# EAGLE design eprom-player (EAGLE 6.1)
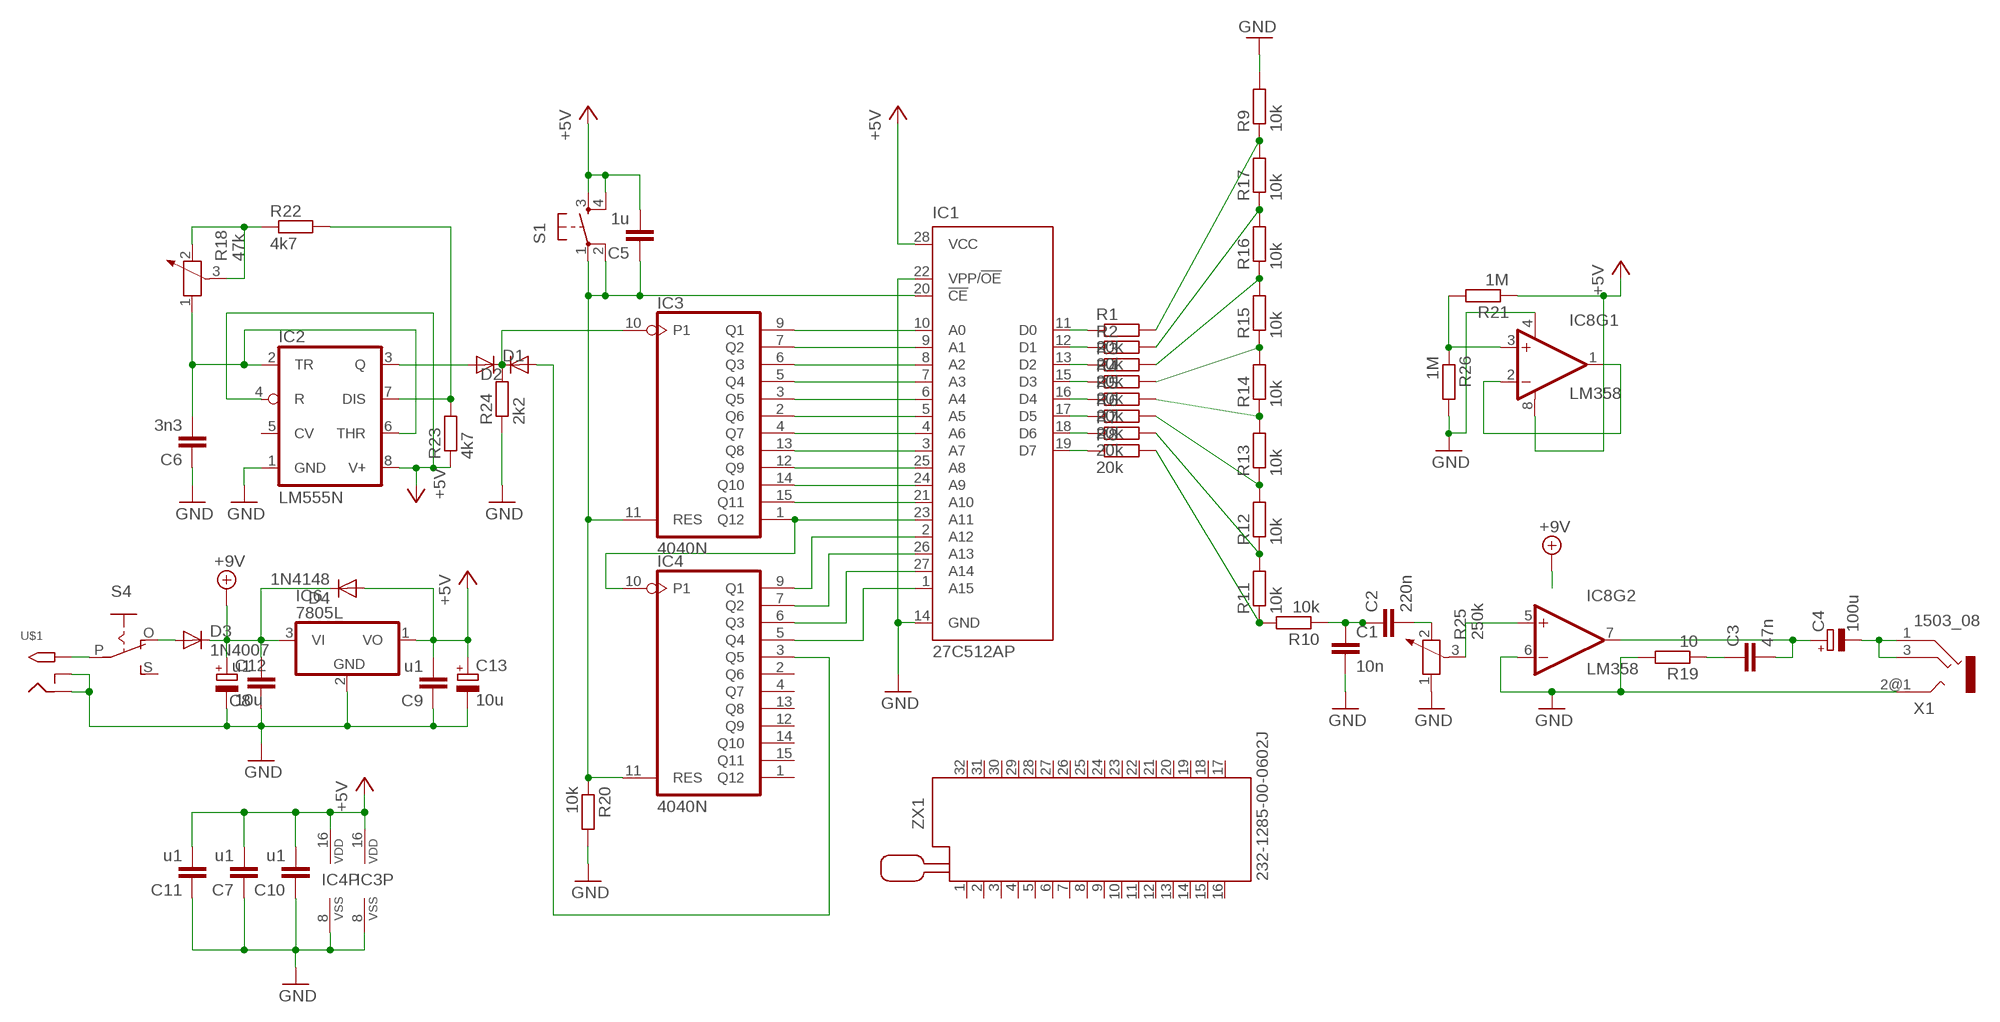
[diagram p0: schematic, sheet 1]

## Parts
C1  10n  C-EU025-025X050  [C025-025X050]
C2  220n  C-EU025-025X050  [C025-025X050]
C3  47n  C-EU025-025X050  [C025-025X050]
C4  100u  CPOL-EUE2.5-5  [E2,5-5]
C5  1u  C-EU025-025X050  [C025-025X050]
C6  3n3  C-EU025-025X050  [C025-025X050]
C7  u1  C-EU025-025X050  [C025-025X050]
C8  u1  C-EU025-025X050  [C025-025X050]
C9  u1  C-EU025-025X050  [C025-025X050]
C10  u1  C-EU025-025X050  [C025-025X050]
C11  u1  C-EU025-025X050  [C025-025X050]
C12  10u  CPOL-EUE2.5-6  [E2,5-6]
C13  10u  CPOL-EUE2.5-6  [E2,5-6]
D1  DIODE-D-7.5  [D-7.5]
D2  DIODE-D-7.5  [D-7.5]
D3  1N4007  DIODE-D-2.5  [D-2.5]
D4  1N4148  DIODE-D-2.5  [D-2.5]
IC1  27C512AP  [DIL28-6]
IC2  LM555N  [DIL08-ROUND]
IC3  4040N  [DIL16]
IC4  4040N  [DIL16]
IC6  7805L  [TO92]
IC8  LM358  [DIP08]
R1  20k  R-EU_0204/7  [0204/7]
R2  20k  R-EU_0204/7  [0204/7]
R3  20k  R-EU_0204/7  [0204/7]
R4  20k  R-EU_0204/2V  [0204V]
R5  20k  R-EU_0204/2V  [0204V]
R6  20k  R-EU_0204/2V  [0204V]
R7  20k  R-EU_0204/2V  [0204V]
R8  20k  R-EU_0204/2V  [0204V]
R9  10k  R-EU_0204/2V  [0204V]
R10  10k  R-EU_0204/2V  [0204V]
R11  10k  R-EU_0204/2V  [0204V]
R12  10k  R-EU_0204/2V  [0204V]
R13  10k  R-EU_0204/2V  [0204V]
R14  10k  R-EU_0204/2V  [0204V]
R15  10k  R-EU_0204/2V  [0204V]
R16  10k  R-EU_0204/2V  [0204V]
R17  10k  R-EU_0204/2V  [0204V]
R18  47k  POTENTIOMETER_PT-10  [PT-10]
R19  10  R-EU_0204/5  [0204/5]
R20  10k  R-EU_0204/2V  [0204V]
R21  1M  R-EU_0204/2V  [0204V]
R22  4k7  R-EU_0204/2V  [0204V]
R23  4k7  R-EU_0204/2V  [0204V]
R24  2k2  R-EU_0204/2V  [0204V]
R25  250k  POTENTIOMETER_PT-10  [PT-10]
R26  1M  R-EU_0204/2V  [0204V]
S1  TAC_SWITCHPTH  [TACTILE-PTH]
S4  EG1218S  [EG1218]
U$1  2.1MMJACKTHM  [PJ-102A]
X1  1503_08  [1503_08]
ZX1  232-1285-00-0602J  [232-1285-00-0602J]

## Nets
+5V: C5.2 C7.2 C9.2 C10.2 C11.2 C13.+ D4.A IC1.28(VCC) IC2.4(R) IC2.8(V+) IC3.16(VDD) IC4.16(VDD) IC6.1(VO) IC8.8(V+) R21.1 R23.1 S1.3 S1.4
+9V: C8.2 C12.+ D3.C D4.C IC6.3(VI)
GND: C1.2 C6.1 C7.1 C8.1 C9.1 C10.1 C11.1 C12.- C13.- IC1.14(GND) IC1.22(VPP/!OE) IC2.1(GND) IC3.8(VSS) IC4.8(VSS) IC6.2(GND) IC8.4(V-) IC8.6(-IN) R9.2 R19.2 R20.2 R24.1 R25.1 R26.2 U$1.RING U$1.RING_SW X1.2@1
N$1: IC1.11(D0) R1.1
N$2: IC1.12(D1) R2.1
N$3: IC1.13(D2) R3.1
N$4: IC1.15(D3) R4.1
N$5: IC1.16(D4) R5.1
N$6: IC1.17(D5) R6.1
N$7: IC1.18(D6) R7.1
N$8: IC1.19(D7) R8.1
N$9: IC1.23(A11) IC3.1(Q12) IC4.10(P1)
N$10: IC1.5(A5) IC3.2(Q6)
N$11: IC1.6(A4) IC3.3(Q5)
N$12: IC1.4(A6) IC3.4(Q7)
N$13: IC1.7(A3) IC3.5(Q4)
N$14: IC1.8(A2) IC3.6(Q3)
N$15: IC1.9(A1) IC3.7(Q2)
N$16: IC1.10(A0) IC3.9(Q1)
N$17: IC1.25(A8) IC3.12(Q9)
N$18: IC1.3(A7) IC3.13(Q8)
N$19: IC1.24(A9) IC3.14(Q10)
N$20: IC1.21(A10) IC3.15(Q11)
N$21: IC1.2(A12) IC4.9(Q1)
N$22: IC1.26(A13) IC4.7(Q2)
N$23: IC1.27(A14) IC4.6(Q3)
N$24: IC1.1(A15) IC4.5(Q4)
N$25: R8.2 R10.2 R11.1
N$26: R7.2 R11.2 R12.1
N$27: R5.2 R13.2 R14.1
N$28: R4.2 R14.2 R15.1
N$29: R2.2 R16.2 R17.1
N$30: R6.2 R12.2 R13.1
N$31: R3.2 R15.2 R16.1
N$32: R1.2 R9.1 R17.2
N$33: C1.1 C2.1 R10.1
N$34: C2.2 R25.2
N$35: C4.- X1.1 X1.3
N$36: IC8.5(+IN) R25.3
N$37: C3.1 R19.1
N$38: C3.2 C4.+ IC8.7(OUT)
N$39: C5.1 IC1.20(!CE) IC3.11(RES) IC4.11(RES) R20.1 S1.1 S1.2
N$40: D1.C D2.C IC3.10(P1) R24.2
N$41: D1.A IC2.3(Q)
N$42: C6.2 IC2.2(TR) IC2.6(THR) R18.1
N$43: S4.P U$1.TIP
N$44: R18.2 R18.3 R22.1
N$45: IC2.7(DIS) R22.2 R23.2
N$46: D2.A IC4.3(Q5)
N$47: D3.A S4.O
N$48: IC8.1(OUT) IC8.2(-IN)
N$49: IC8.3(+IN) R21.2 R26.1
Unconnected: IC2.5(CV) IC4.1(Q12) IC4.2(Q6) IC4.4(Q7) IC4.12(Q9) IC4.13(Q8) IC4.14(Q10) IC4.15(Q11) S4.S X1.2@2 ZX1.1 ZX1.2 ZX1.3 ZX1.4 ZX1.5 ZX1.6 ZX1.7 ZX1.8 ZX1.9 ZX1.10 ZX1.11 ZX1.12 ZX1.13 ZX1.14 ZX1.15 ZX1.16 ZX1.17 ZX1.18 ZX1.19 ZX1.20 ZX1.21 ZX1.22 ZX1.23 ZX1.24 ZX1.25 ZX1.26 ZX1.27 ZX1.28 ZX1.29 ZX1.30 ZX1.31 ZX1.32

## Library data of the parts
C1-C3 C5-C11 = rcl:C-EU: CAPACITOR, European symbol
C4 C12 C13 = rcl:CPOL-EU: POLARIZED CAPACITOR, European symbol
D1-D4 = diode:DIODE-: DIODE
IC1 = microchip:27*512A: CMOS EPROM 512 K (64 K x 8); MPN: M27C512-90B6; OC_FARNELL: 1642690; OC_NEWARK: 20M6389
IC2 = adafruit:*555: TIMER Changed DIP package to have round (not oval) pin pads http://www.ladyada.net/library/pcb/eaglelibrary.html
IC3 IC4 = 40xx:4040: 12-stage binary/ripple COUNTER
IC6 = adafruit_t10:78*: Positive VOLTAGE REGULATOR Added bigger pads to the TO-92 package
IC8 = SparkFun-AnalogIC:LM358: Jellybean op-amp; PROD_ID: IC-09172
R1-R17 R19-R24 R26 = rcl:R-EU_: RESISTOR, European symbol
R18 R25 = rcl:POTENTIOMETER_: Potentiometer
S1 = SparkFun-Electromechanical:TAC_SWITCH: Momentary Switch Button commonly used for reset or general input. Spark Fun Electronics SKU : COM-00097 SMT- SWCH-08247
S4 = _MY_OWN_LIB:EG1218: SLIDING SWITCH 0.1" spacing through hole, vertical SPDT slide switch http://www.ladyada.net/library/pcb/eaglelibrary.html
U$1 = adafruit:2.1MMJACK: 2.1mm x 5.5mm THM DC jack with internal switch. Digikey part #PJ-102A, 4UCON part #05537 2.1mm x 5.5mm SMT DC jack with internal switch. Digikey part #PJ-002A-SMT, 4UCON part #03267 By microbuilder.eu & adafruit.com
X1 = con-lumberg:1503_?: Jack connectors according to JISC 6560, 3.5 mm Klinkensteckverbinder nach JISC 6560, 3,5 mm Source: http://www.lumberg.com/Produkte/PDFs/1503_08.pdf; OC_FARNELL: unknown; OC_NEWARK: unknown
ZX1 = con-3m:232-?: Zero Insertion Force Socked Source: http://www.3M.com/ehpd; MF: 3M; MPN: 232-1285-00-0602J; OC_FARNELL: 9897402; OC_NEWARK: 85K7839

## Board
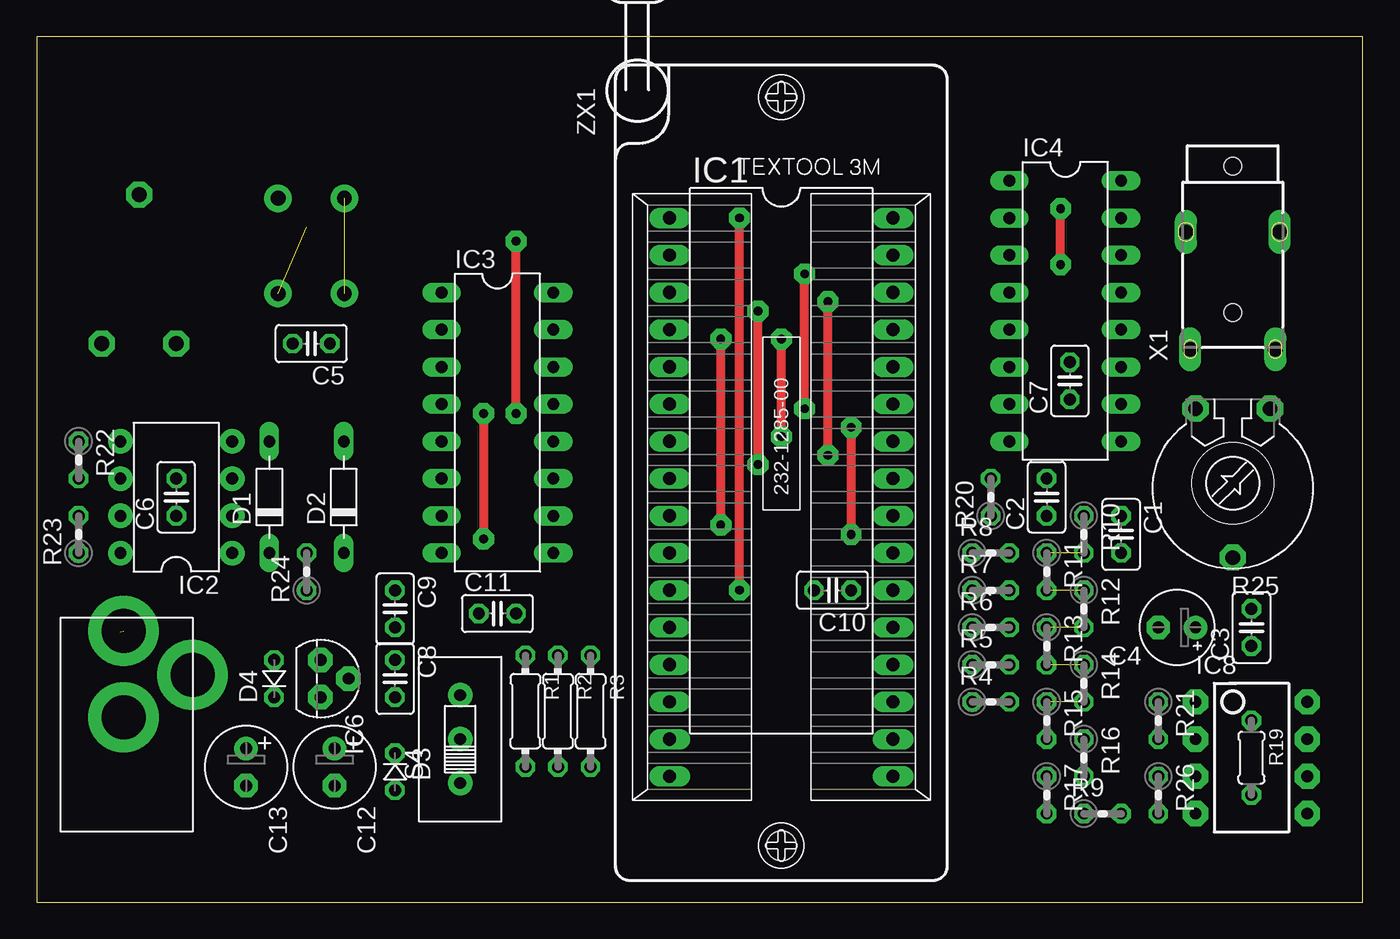
[diagram p1: board, top side]
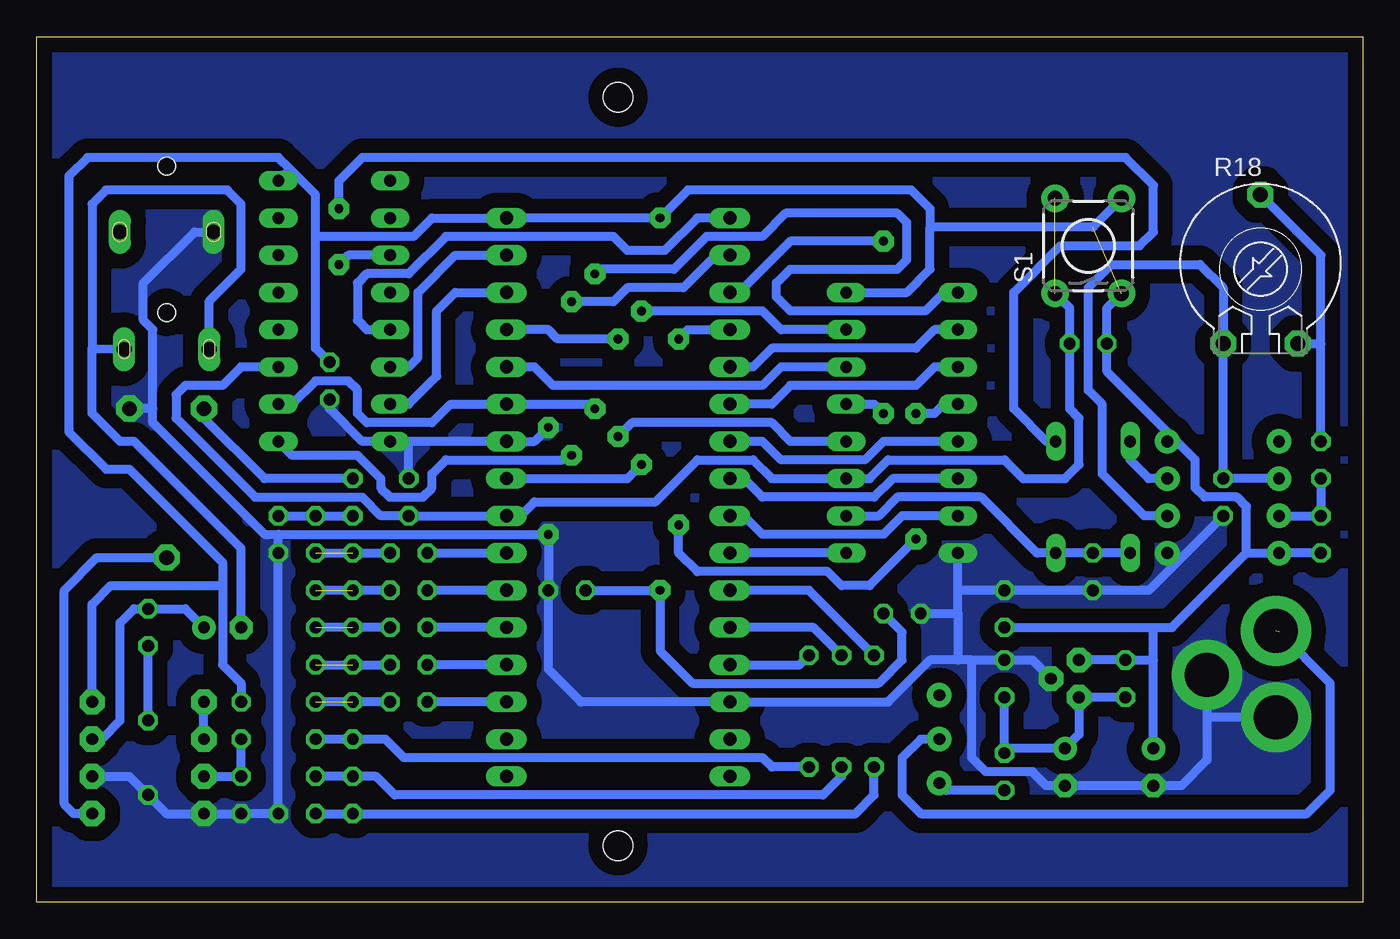
[diagram p2: board, bottom side, seen from below]

Size 90.47 x 59.04 mm. Coordinates in mm from the lower left corner, seen from the top.
Outline: 0,0 90.47,0 90.47,59.04 0,59.04 0,0
Copper layers (1*16): Top 0.035mm / dielectric 1.5mm / Bottom 0.035mm
Design rules: minimum track width 10mil, minimum drill 24mil, track to track 12mil, track to pad 12mil, pad to pad 12mil, via to via 12mil, smd to smd 10mil, copper to edge 12mil, drill to drill 12mil, minimum pad ring 10mil, minimum via ring 10mil, stop-mask expansion 4mil, vias tented up to drill 0mil, thermal gap 12mil

### Footprints (pad centres in the part's own frame; a part is rotated, then mirrored left to right if it is on the bottom)
C025-025X050 = drill 0.813 octagon: 1 -1.27,0; 2 1.27,0
E2,5-5 = drill 0.813 pad 1.6: + -1.27,0 | drill 0.813 pad 1.6 octagon: - 1.27,0
E2,5-6 = drill 0.813 pad 1.6: + -1.27,0 | drill 0.813 pad 1.6 octagon: - 1.27,0
D-7.5 = drill 0.813 long: A 3.81,0; C -3.81,0
D-2.5 = drill 0.813 octagon: A 1.27,0; C -1.27,0
DIL28-6 = drill 0.813 long: 1 -16.51,-7.62; 2 -13.97,-7.62; 3 -11.43,-7.62; 4 -8.89,-7.62; 5 -6.35,-7.62; 6 -3.81,-7.62; 7 -1.27,-7.62; 8 1.27,-7.62; 9 3.81,-7.62; 10 6.35,-7.62; 11 8.89,-7.62; 12 11.43,-7.62; 13 13.97,-7.62; 14 16.51,-7.62; 15 16.51,7.62; 16 13.97,7.62; 17 11.43,7.62; 18 8.89,7.62; 19 6.35,7.62; 20 3.81,7.62; 21 1.27,7.62; 22 -1.27,7.62; 23 -3.81,7.62; 24 -6.35,7.62; 25 -8.89,7.62; 26 -11.43,7.62; 27 -13.97,7.62; 28 -16.51,7.62
DIL08-ROUND = drill 0.813 pad 1.676: 1 -3.81,-3.81; 2 -1.27,-3.81; 3 1.27,-3.81; 4 3.81,-3.81; 5 3.81,3.81; 6 1.27,3.81; 7 -1.27,3.81; 8 -3.81,3.81
DIL16 = drill 0.813 long: 1 -8.89,-3.81; 2 -6.35,-3.81; 3 -3.81,-3.81; 4 -1.27,-3.81; 5 1.27,-3.81; 6 3.81,-3.81; 7 6.35,-3.81; 8 8.89,-3.81; 9 8.89,3.81; 10 6.35,3.81; 11 3.81,3.81; 12 1.27,3.81; 13 -1.27,3.81; 14 -3.81,3.81; 15 -6.35,3.81; 16 -8.89,3.81
TO92 = drill 0.813 pad 1.676 octagon: 1 -1.27,0; 2 0,1.905; 3 1.27,0
DIP08 = drill 0.813 pad 1.727 octagon: 1 -3.81,-3.81; 2 -1.27,-3.81; 3 1.27,-3.81; 4 3.81,-3.81; 5 3.81,3.81; 6 1.27,3.81; 7 -1.27,3.81; 8 -3.81,3.81
0204/7 = drill 0.813 octagon: 1 -3.81,0; 2 3.81,0
0204V = drill 0.813 octagon: 1 -1.27,0; 2 1.27,0
PT-10 = drill 1.016 pad 1.778 octagon: 1 -2.54,-5.08; 2 2.54,-5.08; 3 0,5.08
0204/5 = drill 0.813 octagon: 1 -2.54,0; 2 2.54,0
TACTILE-PTH = drill 1.016 pad 1.88: 1 -3.251,2.261; 2 3.251,2.261; 3 -3.251,-2.261; 4 3.251,-2.261
EG1218 = drill 0.8 pad 1.676: O -3,0; P 0,0; S 3,0
PJ-102A = drill 3 pad 4.8: RING 0.1,-3.39; RING_SW -4.6,-6.29; TIP 0.1,-9.29
1503_08 = drill 1 pad 1.2 long: 1 -2.9,-8; 2@1 -3.2,0; 2@2 3.2,0; 3 2.9,-8 | hole 1.2: 0,4.5; 0,-5.5
232-1285-00-0602J = drill 0.9 long: 1 -19.05,-7.62; 2 -16.51,-7.62; 3 -13.97,-7.62; 4 -11.43,-7.62; 5 -8.89,-7.62; 6 -6.35,-7.62; 7 -3.81,-7.62; 8 -1.27,-7.62; 9 1.27,-7.62; 10 3.81,-7.62; 11 6.35,-7.62; 12 8.89,-7.62; 13 11.43,-7.62; 14 13.97,-7.62; 15 16.51,-7.62; 16 19.05,-7.62; 17 19.05,7.62; 18 16.51,7.62; 19 13.97,7.62; 20 11.43,7.62; 21 8.89,7.62; 22 6.35,7.62; 23 3.81,7.62; 24 1.27,7.62; 25 -1.27,7.62; 26 -3.81,7.62; 27 -6.35,7.62; 28 -8.89,7.62; 29 -11.43,7.62; 30 -13.97,7.62; 31 -16.51,7.62; 32 -19.05,7.62 | hole 2: 23.78,0; -27.28,0

### Placement (x,y rotation side)
C1  73.98,25.08 270 top
C2  68.9,27.62 90 top
C3  82.87,18.73 90 top
C4  77.79,18.73 180 top
C5  18.73,38.1 180 top
C6  9.53,27.62 90 top
C7  70.48,35.56 90 top
C8  24.45,15.24 270 top
C9  24.45,20 270 top
C10  54.29,21.27 180 top
C11  31.43,19.68 0 top
C12  20.32,9.21 270 top
C13  14.29,9.21 270 top
D1  15.88,27.62 90 top
D2  20.95,27.62 90 top
D3  24.45,8.89 270 top
D4  16.19,15.24 90 top
IC1  50.8,30.16 270 top
IC2  9.53,27.62 90 top
IC3  31.43,32.7 270 top
IC4  70.17,40.32 270 top
IC6  19.37,15.24 270 top
IC8  82.87,9.84 270 top
R1  33.34,13.02 270 top
R2  35.56,13.02 270 top
R3  37.78,13.02 270 top
R4  65.09,13.65 0 top
R5  65.09,16.19 0 top
R6  65.09,18.73 0 top
R7  65.09,21.27 0 top
R8  65.09,23.81 0 top
R9  72.71,6.03 0 top
R10  71.44,25.08 270 top
R11  68.9,22.54 270 top
R12  71.44,20 270 top
R13  68.9,17.46 270 top
R14  71.44,14.92 270 top
R15  68.9,12.38 270 top
R16  71.44,9.84 270 top
R17  68.9,7.3 270 top
R18  6.99,43.18 0 bottom
R19  82.87,9.84 270 top
R20  65.09,27.62 90 top
R21  76.52,12.38 270 top
R22  2.86,30.16 270 top
R23  2.86,25.08 90 top
R24  18.41,22.54 90 top
R25  81.6,28.57 180 top
R26  76.52,7.3 270 top
S1  18.73,44.77 90 bottom
S4  28.89,11.11 90 top
U$1  6.03,9.21 180 top
X1  81.6,45.72 0 top
ZX1  50.8,27.62 270 top

### Tracks (layer width: path | path; a pad name or v marks a point on that pad's centre or on a via)
+5V  (via drill 0.6 pad 1.42)  (1 unrouted)
  Top 0.61: v47.94,21.27 v47.94,46.67
  Bottom 0.61: R21.1 76.52,14.92 77.79,16.19 77.79,21.59 | 77.79,21.59 77.79,23.18 84.14,29.53 85.72,29.53 88.27,32.07 88.27,49.53 87,50.8 73.98,50.8 73.18,50.01 | IC8.8 86.68,20.32 85.41,21.59 77.79,21.59 | C10.2 v47.94,21.27 47.94,17.14 45.72,14.92 33.02,14.92 31.43,16.51 31.43,18.41 C11.2 | C13.+ 14.29,16.51 | 14.29,16.51 14.29,18.73 | 7.94,23.81 IC2.8 R23.1 | 7.94,23.81 7.94,26.99 8.57,27.62 10.79,27.62 11.43,28.26 11.43,30.16 13.02,31.75 | S1.3 17.46,40.53 C5.2 17.46,36.2 13.02,31.75 | IC2.4 13.02,31.75 | C9.2 14.29,18.73 | 14.29,18.73 13.02,18.73 7.94,23.81 | S1.4 16.47,47.98 18.41,46.04 29.53,46.04 | IC3.16 31.11,41.59 29.53,43.18 29.53,46.04 | 29.53,46.04 29.53,47.31 30.8,48.58 46.04,48.58 v47.94,46.67 IC1.28 63.5,46.67 64.77,45.4 71.44,45.4 | IC6.1 D4.A 14.29,16.51 | 71.44,45.4 71.44,48.26 73.18,50.01 | IC4.16 73.18,50.01 | C7.2 71.44,37.78 71.44,45.4
+9V
  Bottom 0.61: D3.C 24.45,10.48 | 24.45,10.48 C8.2 | 24.45,10.48 C12.+ 19.37,11.43 IC6.3 D4.C
GND  (via drill 0.6 pad 1.42)
  Top 0.61: v55.56,32.38 v55.56,25.08
  Bottom 0.61: IC8.6 84.14,8.57 81.6,6.03 IC8.4 R26.2 R9.2 C1.2 73.98,25.08 | 73.98,25.08 74.93,25.08 82.55,32.7 82.55,33.66 | 82.55,33.66 R25.1 | 82.55,33.66 82.55,39.05 83.19,39.69 83.19,42.23 79.69,45.72 X1.2@1 | 73.98,25.08 v55.56,25.08 C10.1 55.56,15.88 53.34,13.65 IC1.14 32.38,13.65 29.53,16.51 27.62,16.51 | 65.09,31.43 IC1.22 56.52,31.43 v55.56,32.38 | R20.2 65.09,31.43 | 65.09,31.43 IC4.8 68.26,31.43 70.48,33.66 C7.1 | 27.62,19.68 27.62,21.27 | 27.62,21.27 IC3.8 | 26.67,16.51 26.67,9.84 25.72,8.89 22.54,8.89 21.59,7.94 C12.- C13.- 12.38,7.94 10.63,9.69 10.63,12.7 | 26.67,16.51 C8.1 22.54,16.51 IC6.2 | 26.67,16.51 27.62,16.51 | C11.1 27.62,19.68 | 27.62,19.68 27.62,16.51 | C6.1 12.7,23.18 | 12.7,23.18 14.61,21.27 R24.1 C9.1 27.62,21.27 | IC2.1 12.7,23.18 | U$1.RING_SW 10.63,12.7 | U$1.RING 10.53,12.6 10.63,12.7
  pour Bottom (isolate 1.016, no thermals): 89.22,0.95 0.95,0.95 0.95,57.78 89.22,57.78
N$1
  Bottom 0.61: R1.1 37.78,21.27 IC1.11
N$2
  Bottom 0.61: R2.1 37.47,18.73 IC1.12
N$3
  Bottom 0.61: IC1.13 38.42,16.19 R3.1
N$4
  Bottom 0.61: IC1.15 R4.1
N$5
  Bottom 0.61: IC1.16 R5.1
N$6
  Bottom 0.61: IC1.17 R6.1
N$7
  Bottom 0.61: IC1.18 R7.1
N$8
  Bottom 0.61: R8.1 IC1.19
N$9  (via drill 0.6 pad 1.42)
  Top 0.61: v52.39,33.66 v52.39,42.86
  Bottom 0.61: v52.39,33.66 52.7,33.97 IC1.23 62.23,33.97 63.5,32.7 67.94,32.7 68.58,33.34 68.58,34.92 69.22,35.56 71.44,35.56 73.03,33.97 IC4.10 | IC3.1 28.57,41.59 29.84,40.32 39.05,40.32 40.01,41.27 40.01,42.23 39.05,43.18 31.75,43.18 31.11,43.81 31.11,46.35 31.75,46.99 39.37,46.99 40.96,45.4 44.77,45.4 46.99,43.18 52.07,43.18 v52.39,42.86
N$10
  Bottom 0.61: IC3.2 29.21,39.05 30.48,37.78 40.32,37.78 41.59,36.51 IC1.5
N$11
  Bottom 0.61: IC3.3 29.21,36.51 30.48,35.24 39.05,35.24 40.32,33.97 IC1.6
N$12  (via drill 0.6 pad 1.42)
  Top 0.61: v30.48,33.34 v30.48,24.77 | v46.67,25.72 v46.67,38.42
  Bottom 0.61: IC3.4 28.57,33.97 29.21,33.34 v30.48,33.34 | v30.48,24.77 33.66,21.59 35.56,21.59 36.51,22.54 45.4,22.54 46.67,23.81 v46.67,25.72 | v46.67,38.42 46.04,39.05 IC1.4
N$13
  Bottom 0.61: IC3.5 32.7,31.43 33.97,30.16 39.69,30.16 40.96,31.43 IC1.7
N$14
  Bottom 0.61: IC3.6 32.07,28.89 33.34,27.62 40.96,27.62 42.23,28.89 IC1.8
N$15
  Bottom 0.61: IC3.7 31.43,26.35 32.7,25.08 40.96,25.08 42.23,26.35 IC1.9
N$16
  Bottom 0.61: IC3.9 IC1.10
N$17  (via drill 0.6 pad 1.42)
  Top 0.61: v50.8,31.75 v50.8,38.42
  Bottom 0.61: IC3.12 39.05,31.43 40.32,32.7 49.85,32.7 v50.8,31.75 | v50.8,38.42 54.93,38.42 55.56,39.05 IC1.25
N$18  (via drill 0.6 pad 1.42)
  Top 0.61: v32.7,33.34 v32.7,45.09
  Bottom 0.61: IC3.13 33.34,33.97 v32.7,33.34 | v32.7,45.09 39.05,45.09 42.55,41.59 IC1.3
N$19
  Bottom 0.61: IC3.14 39.69,36.51 40.96,35.24 55.24,35.24 56.52,36.51 IC1.24
N$20  (via drill 0.6 pad 1.42)
  Top 0.61: v49.21,29.84 v49.21,40.32
  Bottom 0.61: IC1.21 50.16,28.89 v49.21,29.84 | IC3.15 39.69,39.05 40.96,40.32 v49.21,40.32
N$21  (via drill 0.6 pad 1.42)
  Top 0.61: v53.98,30.48 v53.98,40.96
  Bottom 0.61: v53.98,30.48 54.61,30.16 62.55,30.16 63.5,29.21 63.5,28.26 64.14,27.62 66.36,27.62 66.99,28.26 66.99,28.89 68.58,30.48 73.03,30.48 IC4.9 | v53.98,40.96 51.12,40.96 50.16,41.91 46.35,41.91 44.13,44.13 IC1.2
N$22
  Bottom 0.61: IC4.7 65.09,33.97 63.18,35.88 63.18,40.32 61.91,41.59 IC1.26
N$23
  Bottom 0.61: IC4.6 65.09,36.51 64.45,37.15 64.45,41.59 61.91,44.13 IC1.27
N$24
  Bottom 0.61: IC4.5 67.94,39.05 68.58,39.69 68.58,42.23 67.94,42.86 65.09,42.86 62.55,45.4 51.12,45.4 50.16,44.45 47.62,44.45 45.4,46.67 IC1.1
N$25  (1 unrouted)
  Bottom 0.61: R10.2 R8.2
N$26  (1 unrouted)
  Bottom 0.61: R7.2 R12.1
N$27  (1 unrouted)
  Bottom 0.61: R14.1 R5.2
N$28  (1 unrouted)
  Bottom 0.61: R4.2 R14.2
N$29
  Bottom 0.61: R16.2 R17.1 67.31,8.57 66.04,7.3 36.83,7.3 35.56,8.57 R2.2
N$30  (1 unrouted)
  Bottom 0.61: R6.2 R12.2
N$31
  Bottom 0.61: R3.2 40.32,9.21 40.96,9.84 65.41,9.84 66.67,11.11 R15.2 R16.1
N$32
  Bottom 0.61: R9.1 R17.2 34.61,6.03 33.34,7.3 R1.2
N$33
  Bottom 0.61: C2.1 R10.1 C1.1
N$34
  Bottom 0.61: C2.2 74.93,28.89 79.06,33.02 R25.2
N$35
  Bottom 0.61: X1.1 78.7,41 76.52,43.18 76.52,47.62 77.47,48.58 85.72,48.58 86.68,47.62 86.68,37.76 | 86.68,37.76 86.68,33.34 84.77,31.43 83.82,31.43 76.52,24.13 C4.- | 86.68,37.76 X1.3
N$36
  Bottom 0.61: IC8.5 87.95,6.03 88.58,6.67 88.58,21.27 86.36,23.5 R25.3
N$37
  Bottom 0.61: R19.1 C3.1
N$38
  Bottom 0.61: IC8.7 86.04,11.11 84.77,12.38 84.77,19.05 83.82,20 C3.2 80.33,20 C4.+
N$39  (1 unrouted)
  Bottom 0.61: IC4.11 76.52,36.51 77.79,35.24 80.33,35.24 80.96,34.61 80.96,33.02 75.56,27.62 68.26,27.62 66.99,26.35 R20.1 IC1.20 57.47,26.35 56.52,27.3 48.26,27.3 45.4,30.16 41.59,30.16 40.32,28.89 IC3.11 33.66,28.89 32.38,30.16 24.45,30.16 23.18,28.89 20.32,28.89 19.37,29.84 19.37,33.02 20,33.66 C5.1 20,40.53 S1.1
N$40
  Bottom 0.61: IC3.10 33.02,26.35 31.75,27.62 26.04,27.62 22.23,23.81 D2.C R24.2 D1.C
N$41
  Bottom 0.61: IC2.3 14.61,28.89 15.88,30.16 D1.A
N$42
  Bottom 0.61: IC2.6 C6.2 R18.1 9.53,41.91 11.11,43.5 17.14,43.5 18.73,41.91 18.73,34.92 17.78,33.97 17.78,29.21 14.92,26.35 IC2.2
N$43  (1 unrouted)
  Bottom 0.61: S4.P 30.16,11.11 31.43,9.84 31.43,7.3 30.16,6.03 3.81,6.03 2.22,7.62 2.22,14.92 5.71,18.41
N$44
  Bottom 0.61: R22.1 2.86,38.1 | 2.86,38.1 2.86,44.13 R18.3 | R18.2 2.86,38.1
N$45
  Bottom 0.61: IC2.7 R23.2 R22.2
N$46  (via drill 0.6 pad 1.42)
  Top 0.61: v69.85,43.5 v69.85,47.31
  Bottom 0.61: v69.85,47.31 69.85,49.21 68.26,50.8 16.19,50.8 14.29,48.9 14.29,45.72 15.24,44.77 20.64,44.77 23.81,41.59 23.81,33.66 21.59,31.43 D2.A | IC4.3 69.22,44.13 v69.85,43.5
N$47
  Bottom 0.61: D3.A 28.43,7.62 S4.O
N$48
  Bottom 0.61: IC8.2 IC8.1
N$49
  Bottom 0.61: IC8.3 R26.1 R21.2